# EAGLE design splitflap_01 (EAGLE 6.6.0)
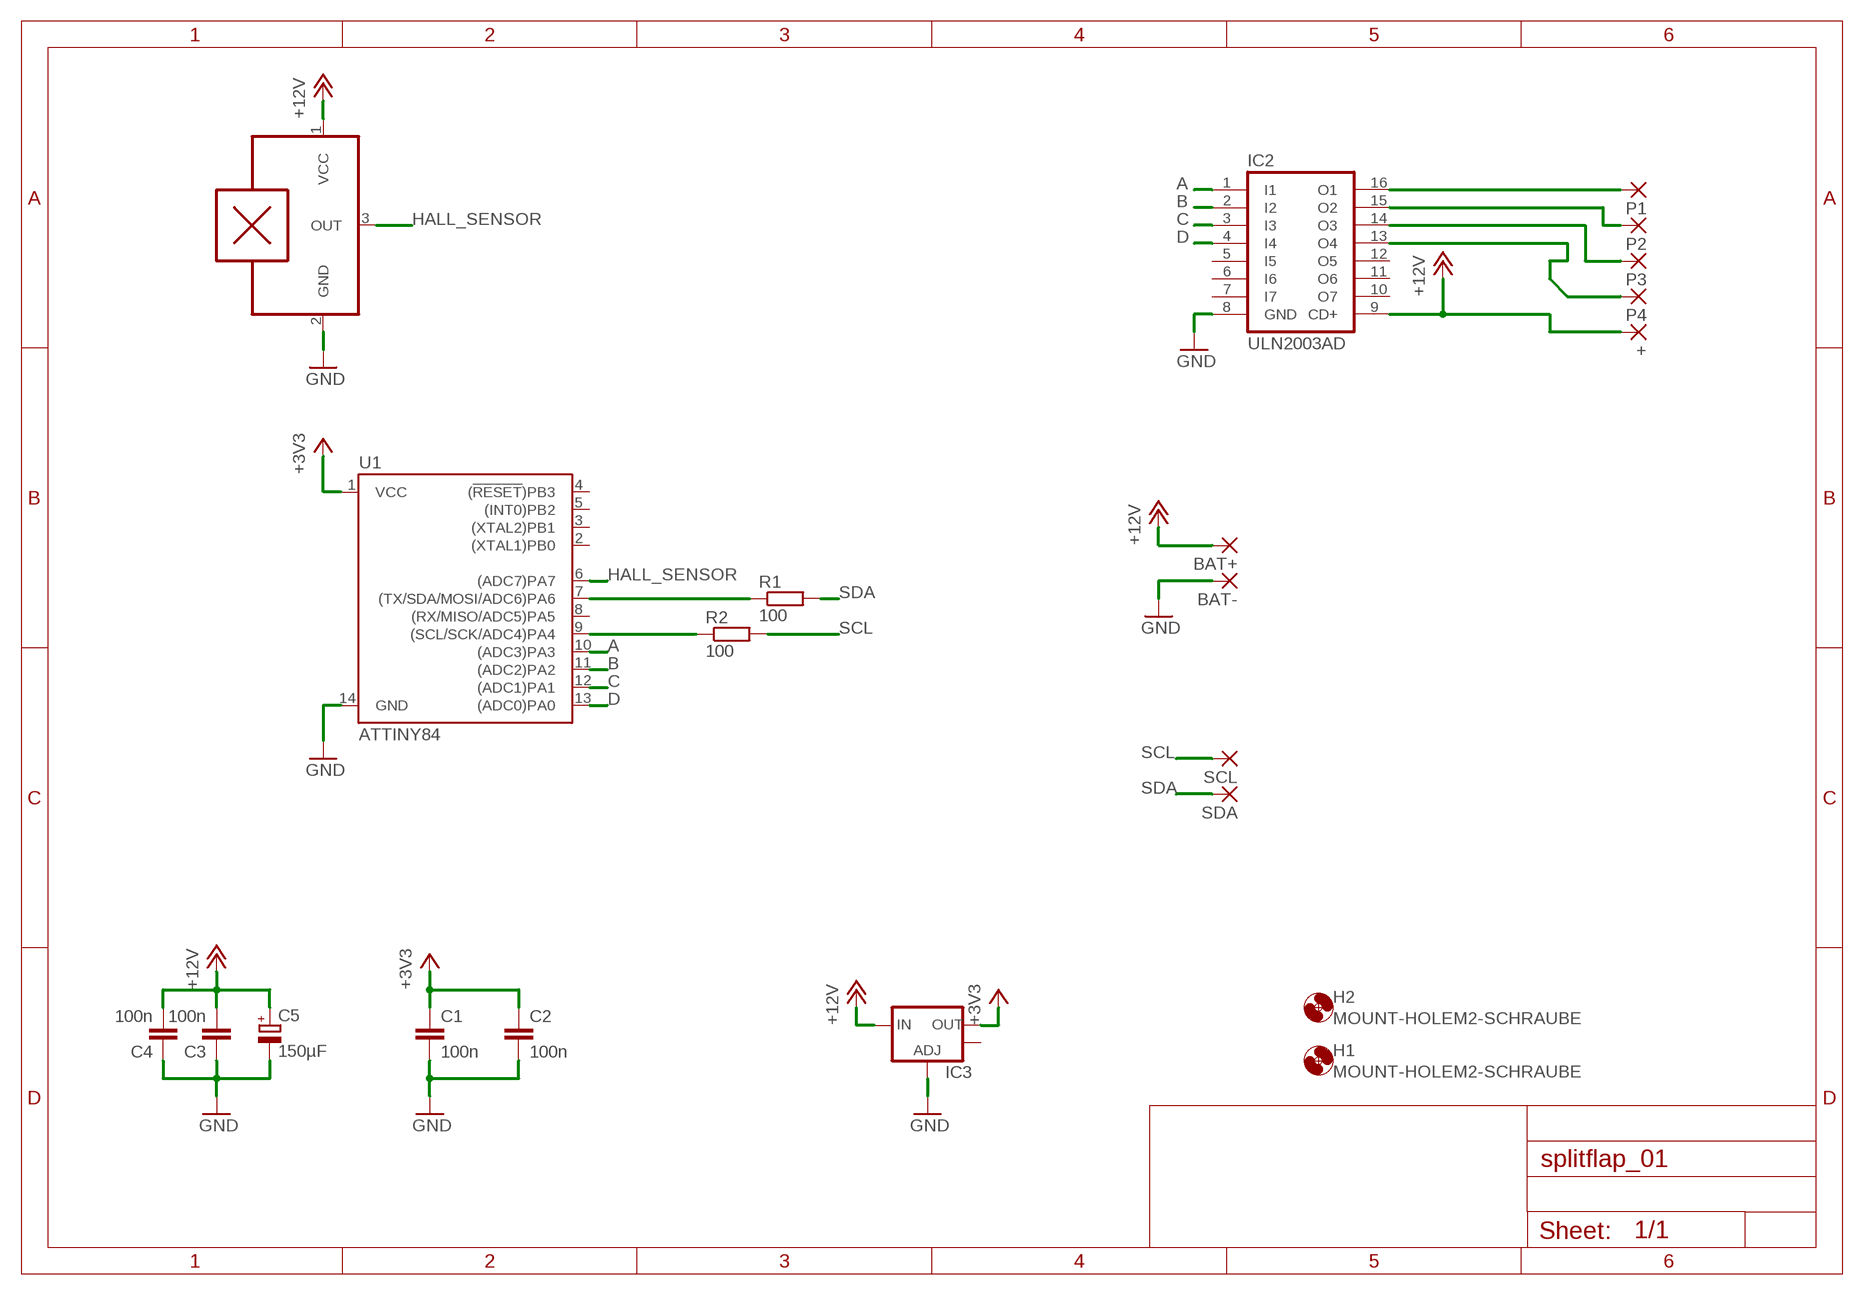
[diagram p0: schematic, sheet 1]

## Parts
+  SMD5  [SMD2,54-5,08]
BAT+  SMD5  [SMD2,54-5,08]
BAT-  SMD5  [SMD2,54-5,08]
C1  100n  C-EUC0805  [C0805]
C2  100n  C-EUC0805  [C0805]
C3  100n  C-EUC0805  [C0805]
C4  100n  C-EUC0805  [C0805]
C5  150µF  CPOL-EUSMCD  [SMC_D]
H1  MOUNT-HOLEM2-SCHRAUBE  [M2-SCHRAUBE]
H2  MOUNT-HOLEM2-SCHRAUBE  [M2-SCHRAUBE]
IC2  ULN2003AD  [SO16]
IC3  V_REG_LM1117SOT223  [SOT223]
P1  SMD5  [SMD2,54-5,08]
P2  SMD5  [SMD2,54-5,08]
P3  SMD5  [SMD2,54-5,08]
P4  SMD5  [SMD2,54-5,08]
R1  100  R-EU_R0805  [R0805]
R2  100  R-EU_R0805  [R0805]
SCL  SMD5  [SMD2,54-5,08]
SDA  SMD5  [SMD2,54-5,08]
U1  ATTINY84  [SO14]
U$1  A3144  [TO-92-LINE]

## Nets
+3V3: C1.1 C2.1 IC3.2(OUT) U1.1(VCC)
+12V: +.1(P) BAT+.1(P) C3.2 C4.2 C5.+ IC2.9(CD+) IC3.3(IN) U$1.1(VCC)
A: IC2.1(I1) U1.10((ADC3)PA3)
B: IC2.2(I2) U1.11((ADC2)PA2)
C: IC2.3(I3) U1.12((ADC1)PA1)
D: IC2.4(I4) U1.13((ADC0)PA0)
GND: BAT-.1(P) C1.2 C2.2 C3.1 C4.1 C5.- IC2.8(GND) IC3.1(ADJ) U1.14(GND) U$1.2(GND)
HALL_SENSOR: U1.6((ADC7)PA7) U$1.3(OUT)
N$1: R1.1 U1.7((TX/SDA/MOSI/ADC6)PA6)
N$2: R2.1 U1.9((SCL/SCK/ADC4)PA4)
N$3: IC2.16(O1) P1.1(P)
N$4: IC2.15(O2) P2.1(P)
N$5: IC2.14(O3) P3.1(P)
N$6: IC2.13(O4) P4.1(P)
SCL: R2.2 SCL.1(P)
SDA: R1.2 SDA.1(P)
Unconnected: IC2.5(I5) IC2.6(I6) IC2.7(I7) IC2.10(O7) IC2.11(O6) IC2.12(O5) IC3.4(OUT) U1.2((XTAL1)PB0) U1.3((XTAL2)PB1) U1.4((!RESET!)PB3) U1.5((INT0)PB2) U1.8((RX/MISO/ADC5)PA5)

## Library data of the parts
+ BAT+ BAT- P1-P4 SCL SDA = my_pads:SMD5: SMD PAD
C1-C4 = my_rcl:C-EU: CAPACITOR, European symbol
C5 = my_rcl:CPOL-EU: POLARIZED CAPACITOR, European symbol
H1 H2 = my_mount:MOUNT-HOLE: MOUNTING HOLE with drill center marker
IC2 = uln-udn:ULN2003A: DRIVER ARRAY
IC3 = my_voltage-regulator:V_REG_LM1117: Voltage Regulator LM1117 Standard adjustable voltage regulator but in SMD form. Spark Fun Electronics SKU : COM-00595
R1 R2 = my_rcl:R-EU_: RESISTOR, European symbol
U1 = SparkFun-IC-Microcontroller:ATTINY84: Atmel 14-pin 2/4/8kB flash uC Datasheet <https://cdn.sparkfun.com/datasheets/Widgets/doc8006.pdf> SparkFun Products Tiny AVR Programmer <https://www.sparkfun.com/products/11801> (PGM-11801) SparkFun Servo Trigger - Continuous Rotation <https://www.sparkfun.com/products/13872> (WIG-13872) SparkFun Servo Trigger <https://www.sparkfun.com/products/13118> (WIG-13118); PROD_ID: IC-11285
U$1 = my_sensors:A3144

## Board
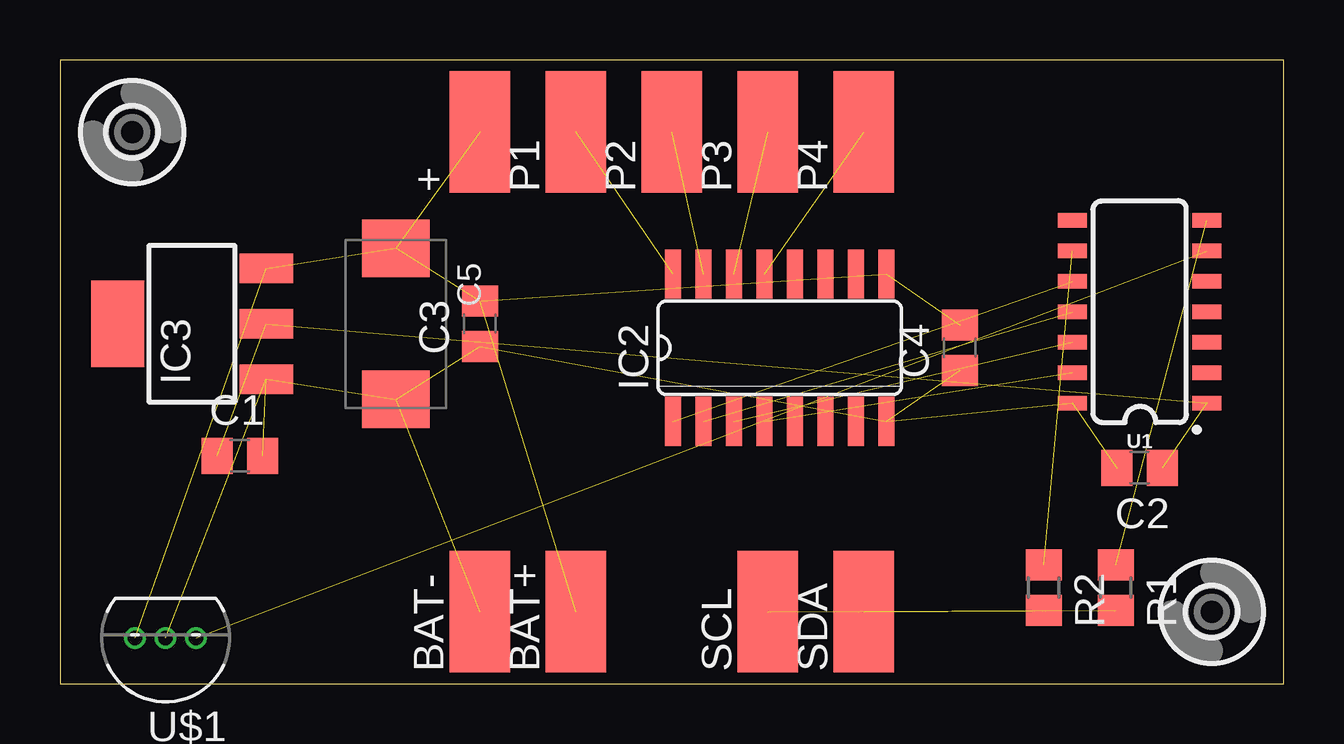
[diagram p1: board, top side]
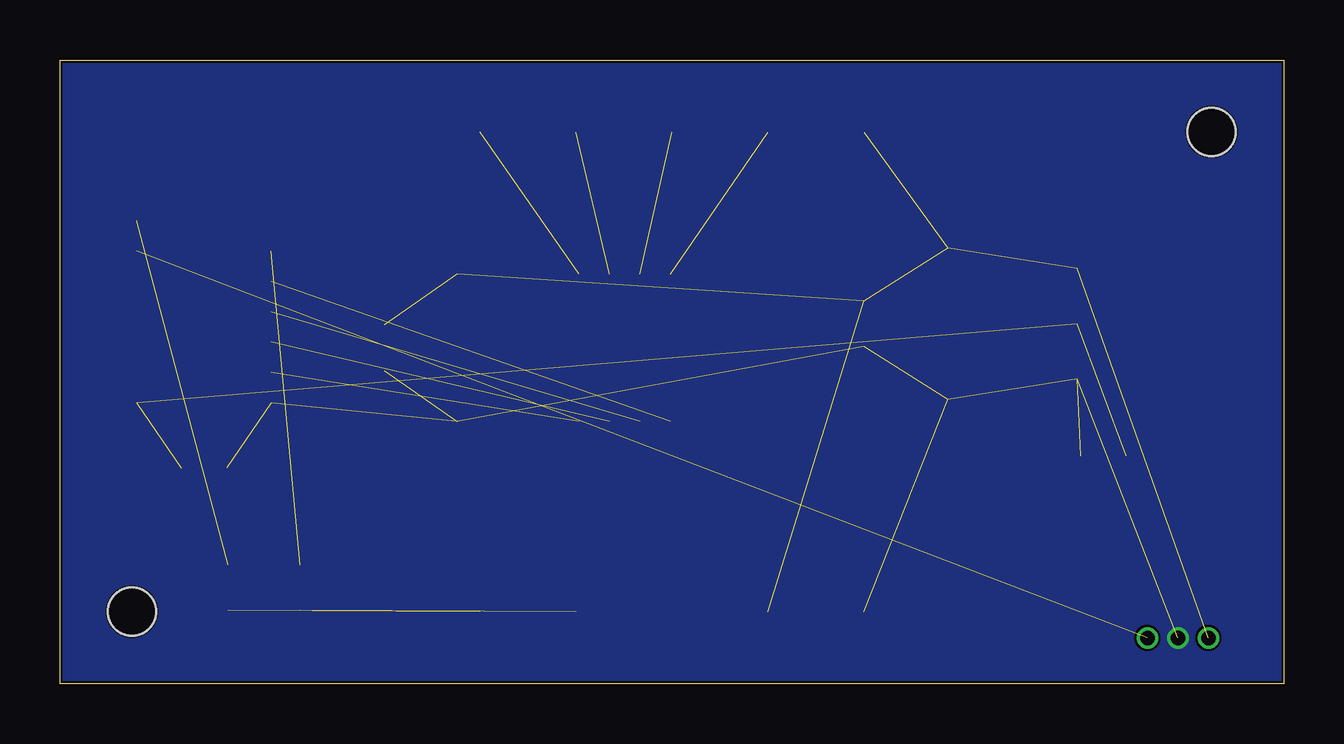
[diagram p2: board, bottom side, seen from below]

Size 51 x 26 mm. Coordinates in mm from the lower left corner, seen from the top.
Outline: 0,0 51,0 51,26 0,26 0,0
Copper layers (1*16): Top 0.035mm / dielectric 0.2mm / Bottom 0.035mm
Design rules "jlcpcb-2-layer": minimum track width 3.5mil, minimum drill 0.2mm, track to track 3.5mil, track to pad 5mil, pad to pad 5mil, via to via 5mil, smd to smd 0mil, copper to edge 0.1mm, drill to drill 5mil, minimum pad ring 4mil, minimum via ring 4mil, stop-mask expansion 3mil, vias tented up to drill 100mil, thermal gap 10mil

### Footprints (pad centres in the part's own frame; a part is rotated, then mirrored left to right if it is on the bottom)
SMD2,54-5,08 = smd 2.54 x 5.08: 1 0,0
C0805 = smd 1.3 x 1.5: 1 -0.95,0; 2 0.95,0
SMC_D = smd 2.4 x 2.8: + -3.15,0; - 3.15,0
M2-SCHRAUBE = hole 2: 0,0
SO16 = smd 0.66 x 2.032: 1 -4.445,-3.073; 2 -3.175,-3.073; 3 -1.905,-3.073; 4 -0.635,-3.073; 5 0.635,-3.073; 6 1.905,-3.073; 7 3.175,-3.073; 8 4.445,-3.073; 9 4.445,3.073; 10 3.175,3.073; 11 1.905,3.073; 12 0.635,3.073; 13 -0.635,3.073; 14 -1.905,3.073; 15 -3.175,3.073; 16 -4.445,3.073
SOT223 = smd 1.219 x 2.235: 1 -2.311,-3.099; 2 0,-3.099; 3 2.311,-3.099 | smd 3.6 x 2.2: 4 0,3.099
R0805 = smd 1.3 x 1.5: 1 -0.95,0; 2 0.95,0
SO14 = smd 0.6 x 1.2: 1 -3.81,-2.8; 2 -2.54,-2.8; 3 -1.27,-2.8; 4 0,-2.8; 5 1.27,-2.8; 6 2.54,-2.8; 7 3.81,-2.8; 8 3.81,2.8; 9 2.54,2.8; 10 1.27,2.8; 11 0,2.8; 12 -1.27,2.8; 13 -2.54,2.8; 14 -3.81,2.8
TO-92-LINE = drill 0.6: 1 1.27,0; 2 0,0; 3 -1.27,0

### Placement (x,y rotation side)
+  17.5,23 0 top
BAT+  21.5,3 0 top
BAT-  17.5,3 0 top
C1  7.5,9.5 0 top
C2  45,9 180 top
C3  17.5,15 90 top
C4  37.5,14 90 top
C5  14,15 270 top
H1  48,3 0 top
H2  3,23 0 top
IC2  30,14 0 top
IC3  5.5,15 90 top
P1  21.5,23 0 top
P2  25.5,23 0 top
P3  29.5,23 0 top
P4  33.5,23 0 top
R1  44,4 270 top
R2  41,4 270 top
SCL  29.5,3 0 top
SDA  33.5,3 0 top
U1  45,15.5 90 top
U$1  4.4,1.9 180 top

### Tracks (layer width: path | path; a pad name or v marks a point on that pad's centre or on a via)
+3V3  (3 unrouted)
+12V  (7 unrouted)
A  (1 unrouted)
B  (1 unrouted)
C  (1 unrouted)
D  (1 unrouted)
GND  (9 unrouted)
  pour Bottom: 0,0 51,0 51,26 0,26
HALL_SENSOR  (1 unrouted)
N$1  (1 unrouted)
N$2  (1 unrouted)
N$3  (1 unrouted)
N$4  (1 unrouted)
N$5  (1 unrouted)
N$6  (1 unrouted)
SCL  (1 unrouted)
SDA  (1 unrouted)